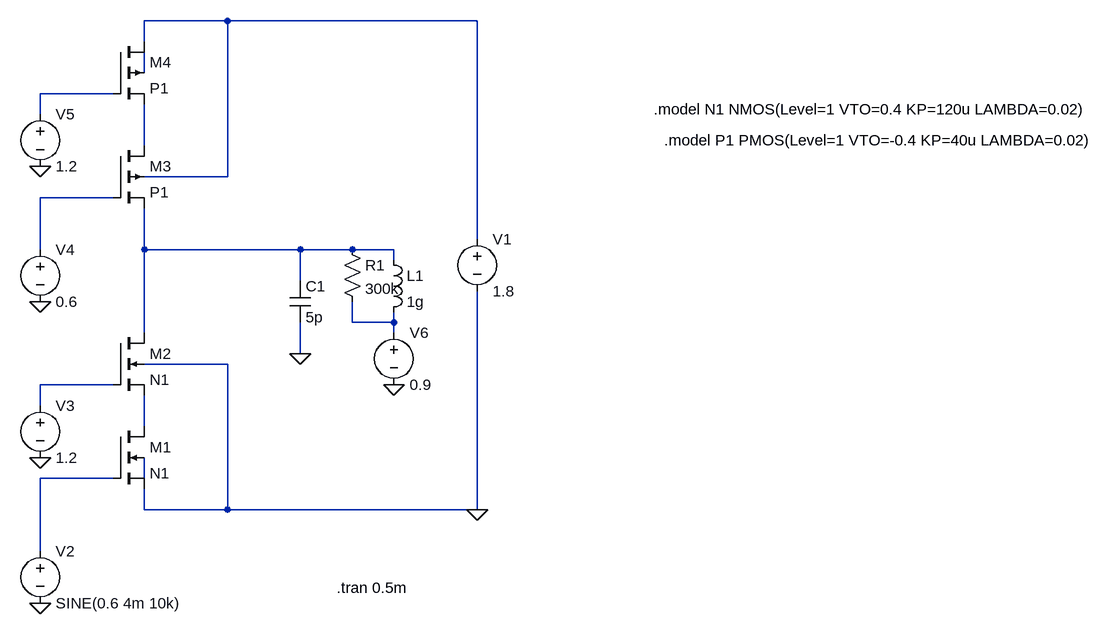
[diagram p0: schematic cs_amplifier.asc]
cs_amplifier.asc, the LTspice schematic file:
Version 4
SHEET 1 1724 680
WIRE 352 -464 224 -464
WIRE 736 -464 352 -464
WIRE 224 -432 224 -464
WIRE 224 -384 224 -416
WIRE 176 -352 64 -352
WIRE 64 -320 64 -352
WIRE 224 -272 224 -336
WIRE 352 -224 352 -464
WIRE 352 -224 224 -224
WIRE 176 -192 64 -192
WIRE 736 -128 736 -464
WIRE 64 -112 64 -192
WIRE 224 -112 224 -176
WIRE 464 -112 224 -112
WIRE 544 -112 464 -112
WIRE 608 -112 544 -112
WIRE 608 -96 608 -112
WIRE 464 -64 464 -112
WIRE 544 0 544 -32
WIRE 608 0 608 -16
WIRE 608 0 544 0
WIRE 224 16 224 -112
WIRE 608 16 608 0
WIRE 464 48 464 0
WIRE 352 64 224 64
WIRE 176 96 64 96
WIRE 64 128 64 96
WIRE 224 160 224 112
WIRE 176 240 64 240
WIRE 224 240 224 208
WIRE 224 288 224 256
WIRE 352 288 352 64
WIRE 352 288 224 288
WIRE 736 288 736 -48
WIRE 736 288 352 288
WIRE 64 352 64 240
FLAG 736 288 0
FLAG 64 432 0
FLAG 64 208 0
FLAG 64 -32 0
FLAG 64 -240 0
FLAG 464 48 0
FLAG 608 96 0
SYMBOL nmos4 176 160 R0
SYMATTR InstName M1
SYMATTR Value N1
SYMATTR Value2 l=2u w=40u
SYMBOL nmos4 176 16 R0
SYMATTR InstName M2
SYMATTR Value N1
SYMATTR Value2 l=2u w=40u
SYMBOL pmos4 176 -272 R0
SYMATTR InstName M3
SYMATTR Value P1
SYMATTR Value2 l=2u w=80u
SYMBOL pmos4 176 -432 R0
SYMATTR InstName M4
SYMATTR Value P1
SYMATTR Value2 l=2u w=80u
SYMBOL voltage 736 -144 R0
WINDOW 123 0 0 Left 0
WINDOW 39 0 0 Left 0
SYMATTR InstName V1
SYMATTR Value 1.8
SYMBOL voltage 64 336 R0
WINDOW 123 24 124 Left 2
WINDOW 39 0 0 Left 0
SYMATTR InstName V2
SYMATTR Value SINE(0.6 4m 10k)
SYMBOL voltage 64 112 R0
WINDOW 123 0 0 Left 0
WINDOW 39 0 0 Left 0
SYMATTR InstName V3
SYMATTR Value 1.2
SYMBOL voltage 64 -128 R0
WINDOW 123 0 0 Left 0
WINDOW 39 0 0 Left 0
SYMATTR InstName V4
SYMATTR Value 0.6
SYMBOL voltage 64 -336 R0
WINDOW 123 0 0 Left 0
WINDOW 39 0 0 Left 0
SYMATTR InstName V5
SYMATTR Value 1.2
SYMBOL cap 448 -64 R0
SYMATTR InstName C1
SYMATTR Value 5p
SYMBOL voltage 608 0 R0
WINDOW 123 0 0 Left 0
WINDOW 39 0 0 Left 0
SYMATTR InstName V6
SYMATTR Value 0.9
SYMBOL ind 592 -112 R0
SYMATTR InstName L1
SYMATTR Value 1g
SYMBOL res 528 -128 R0
SYMATTR InstName R1
SYMATTR Value 300k
TEXT 520 408 Left 2 !.tran 0.5m
TEXT 1008 -328 Left 2 !.model N1 NMOS(Level=1 VTO=0.4 KP=120u LAMBDA=0.02)
TEXT 1024 -280 Left 2 !.model P1 PMOS(Level=1 VTO=-0.4 KP=40u LAMBDA=0.02)

The netlist it stands for:
* cs_amplifier.asc
M1 N009 N010 0 N011 N1 l=2u w=40u
M2 N006 N008 N009 0 N1 l=2u w=40u
M3 N004 N005 N006 N001 P1 l=2u w=80u
M4 N001 N003 N004 N002 P1 l=2u w=80u
V1 N001 0 1.8
V2 N010 0 SINE(0.6 4m 10k)
V3 N008 0 1.2
V4 N005 0 0.6
V5 N003 0 1.2
C1 N006 0 5p
V6 N007 0 0.9
L1 N006 N007 1g
R1 N006 N007 300k
.model NMOS NMOS
.model PMOS PMOS
.lib standard.mos
.tran 0.5m
.model N1 NMOS(Level=1 VTO=0.4 KP=120u LAMBDA=0.02)
.model P1 PMOS(Level=1 VTO=-0.4 KP=40u LAMBDA=0.02)
.backanno
.end